# EAGLE design Adafruit VL6180 Time of Flight Sensor (EAGLE 9.6.2)
COMPANY: ADAFRUIT INDUSTRIES; DRAWN: KTOWN; REV: A
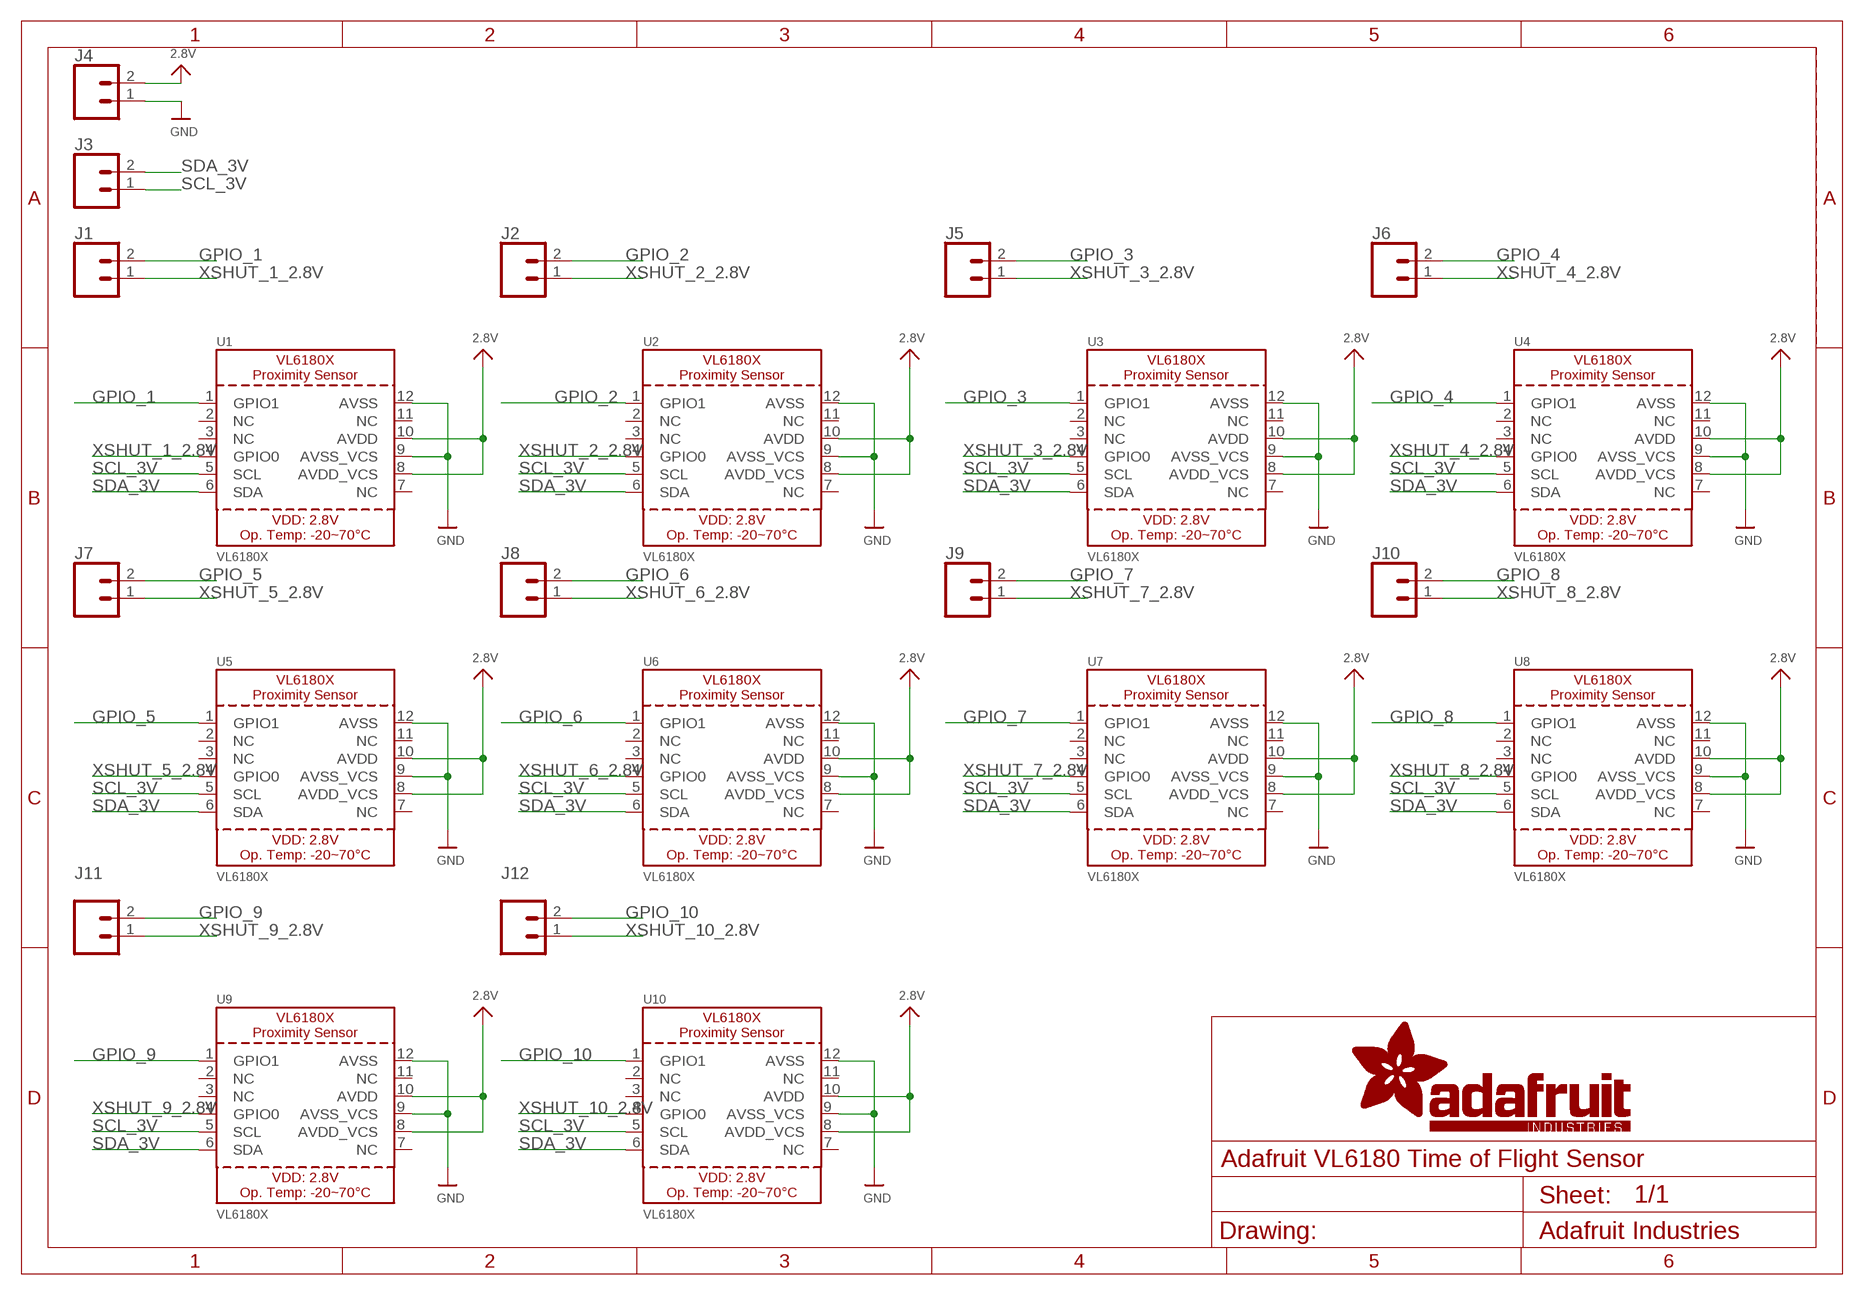
[diagram p0: schematic, sheet 1]

## Parts
J1  CONN_021X02_NO_SILK  [1X02_NO_SILK]
J2  CONN_021X02_NO_SILK  [1X02_NO_SILK]
J3  CONN_021X02_NO_SILK  [1X02_NO_SILK]
J4  CONN_021X02_NO_SILK  [1X02_NO_SILK]
J5  CONN_021X02_NO_SILK  [1X02_NO_SILK]
J6  CONN_021X02_NO_SILK  [1X02_NO_SILK]
J7  CONN_021X02_NO_SILK  [1X02_NO_SILK]
J8  CONN_021X02_NO_SILK  [1X02_NO_SILK]
J9  CONN_021X02_NO_SILK  [1X02_NO_SILK]
J10  CONN_021X02_NO_SILK  [1X02_NO_SILK]
J11  CONN_021X02_NO_SILK  [1X02_NO_SILK]
J12  CONN_021X02_NO_SILK  [1X02_NO_SILK]
U1  VL6180X  [VL6180]
U2  VL6180X  [VL6180]
U3  VL6180X  [VL6180]
U4  VL6180X  [VL6180]
U5  VL6180X  [VL6180]
U6  VL6180X  [VL6180]
U7  VL6180X  [VL6180]
U8  VL6180X  [VL6180]
U9  VL6180X  [VL6180]
U10  VL6180X  [VL6180]

## Nets
2.8V: J4.2 U1.8(AVDD_VCS) U1.10(AVDD) U2.8(AVDD_VCS) U2.10(AVDD) U3.8(AVDD_VCS) U3.10(AVDD) U4.8(AVDD_VCS) U4.10(AVDD) U5.8(AVDD_VCS) U5.10(AVDD) U6.8(AVDD_VCS) U6.10(AVDD) U7.8(AVDD_VCS) U7.10(AVDD) U8.8(AVDD_VCS) U8.10(AVDD) U9.8(AVDD_VCS) U9.10(AVDD) U10.8(AVDD_VCS) U10.10(AVDD)
GND: J4.1 U1.9(AVSS_VCS) U1.12(AVSS) U2.9(AVSS_VCS) U2.12(AVSS) U3.9(AVSS_VCS) U3.12(AVSS) U4.9(AVSS_VCS) U4.12(AVSS) U5.9(AVSS_VCS) U5.12(AVSS) U6.9(AVSS_VCS) U6.12(AVSS) U7.9(AVSS_VCS) U7.12(AVSS) U8.9(AVSS_VCS) U8.12(AVSS) U9.9(AVSS_VCS) U9.12(AVSS) U10.9(AVSS_VCS) U10.12(AVSS)
GPIO_1: J1.2 U1.1(GPIO1)
GPIO_2: J2.2 U2.1(GPIO1)
GPIO_3: J5.2 U3.1(GPIO1)
GPIO_4: J6.2 U4.1(GPIO1)
GPIO_5: J7.2 U5.1(GPIO1)
GPIO_6: J8.2 U6.1(GPIO1)
GPIO_7: J9.2 U7.1(GPIO1)
GPIO_8: J10.2 U8.1(GPIO1)
GPIO_9: J11.2 U9.1(GPIO1)
GPIO_10: J12.2 U10.1(GPIO1)
SCL_3V: J3.1 U1.5(SCL) U2.5(SCL) U3.5(SCL) U4.5(SCL) U5.5(SCL) U6.5(SCL) U7.5(SCL) U8.5(SCL) U9.5(SCL) U10.5(SCL)
SDA_3V: J3.2 U1.6(SDA) U2.6(SDA) U3.6(SDA) U4.6(SDA) U5.6(SDA) U6.6(SDA) U7.6(SDA) U8.6(SDA) U9.6(SDA) U10.6(SDA)
XSHUT_1_2.8V: J1.1 U1.4(GPIO0)
XSHUT_2_2.8V: J2.1 U2.4(GPIO0)
XSHUT_3_2.8V: J5.1 U3.4(GPIO0)
XSHUT_4_2.8V: J6.1 U4.4(GPIO0)
XSHUT_5_2.8V: J7.1 U5.4(GPIO0)
XSHUT_6_2.8V: J8.1 U6.4(GPIO0)
XSHUT_7_2.8V: J9.1 U7.4(GPIO0)
XSHUT_8_2.8V: J10.1 U8.4(GPIO0)
XSHUT_9_2.8V: J11.1 U9.4(GPIO0)
XSHUT_10_2.8V: J12.1 U10.4(GPIO0)
Unconnected: U1.2(NC) U1.3(NC) U1.7(NC) U1.11(NC) U2.2(NC) U2.3(NC) U2.7(NC) U2.11(NC) U3.2(NC) U3.3(NC) U3.7(NC) U3.11(NC) U4.2(NC) U4.3(NC) U4.7(NC) U4.11(NC) U5.2(NC) U5.3(NC) U5.7(NC) U5.11(NC) U6.2(NC) U6.3(NC) U6.7(NC) U6.11(NC) U7.2(NC) U7.3(NC) U7.7(NC) U7.11(NC) U8.2(NC) U8.3(NC) U8.7(NC) U8.11(NC) U9.2(NC) U9.3(NC) U9.7(NC) U9.11(NC) U10.2(NC) U10.3(NC) U10.7(NC) U10.11(NC)

## Library data of the parts
J1-J12 = SparkFun-Connectors:CONN_02: Multi connection point. Often used as Generic Header-pin footprint for 0.1 inch spaced/style header connections On any of the 0.1 inch spaced packages, you can populate with these: Break Away Headers - Straight <https://www.sparkfun.com/products/116> (PRT-00116) Break Away Male Headers - Right Angle <https://www.sparkfun.com/products/553> (PRT-00553) Female Headers <https://www.sparkfun.com/products/115> (PRT-00115) Break Away Headers - Machine Pin <https://www.sparkfun.com/products/117> (PRT-00117) Break Away Female Headers - Swiss Machine Pin <https://www.sparkfun.com/products/743> (PRT-00743) For SCREWTERMINALS and SPRING TERMINALS visit here: Screw Terimnals on SparkFun.com <https://www.sparkfun.com/search/results?term=Screw+Terminals> (5mm/3.5mm/2.54mm spacing) This device is also useful as a general connection point to wire up your design to another part of your project. Our various solder wires solder well into these plated through hole pads. Hook-Up Wire - Assortment (Stranded, 22 AWG) <https://www.sparkfun.com/products/11375> (PRT-11375) Hook-Up Wire - Assortment (Solid Core, 22 AWG) <https://www.sparkfun.com/products/11367> (PRT-11367) View the entire wire category on our website here <https://www.sparkfun.com/categories/141> Special notes: Molex polarized connector foot print use with: PRT-08233 with associated crimp pins and housings. 2.54_SCREWTERM for use with PRT-10571. 3.5mm Screw Terminal footprints for PRT-08084 5mm Screw Terminal footprints for use with PRT-08432
U1-U10 = microbuilder:VL6180X: VL6180x Proximity and Light Sensor with Gesture Recognition Supply Level: 2.8V (3.0V Max!) Range: 0-10cm Light Sensor: 0..100K Lux (16-bit output) IR emitter: 850 nm I2C Address: 0x29 (7-bit)

## Net classes
1 highpower: width 0.406 mm, drill 0.483 mm
2 lowpower: width 0.305 mm, drill 0.483 mm

## Board
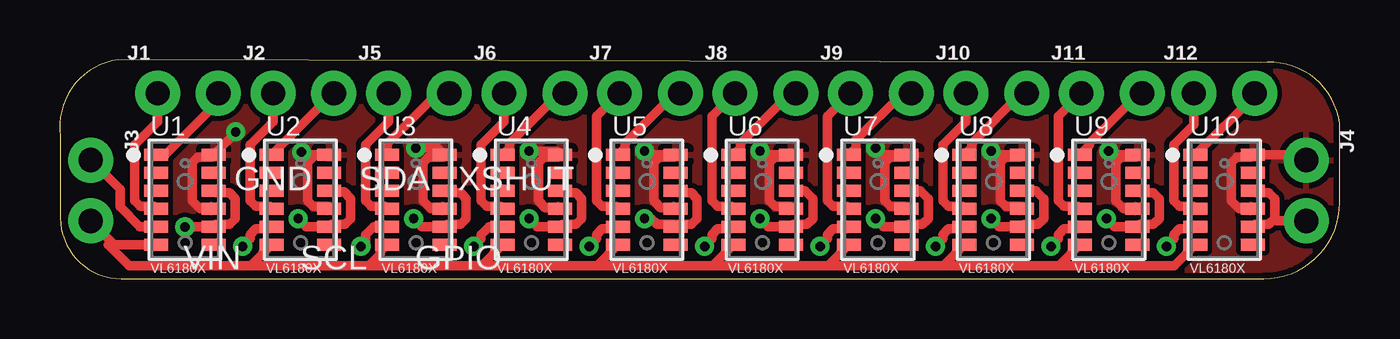
[diagram p1: board, top side]
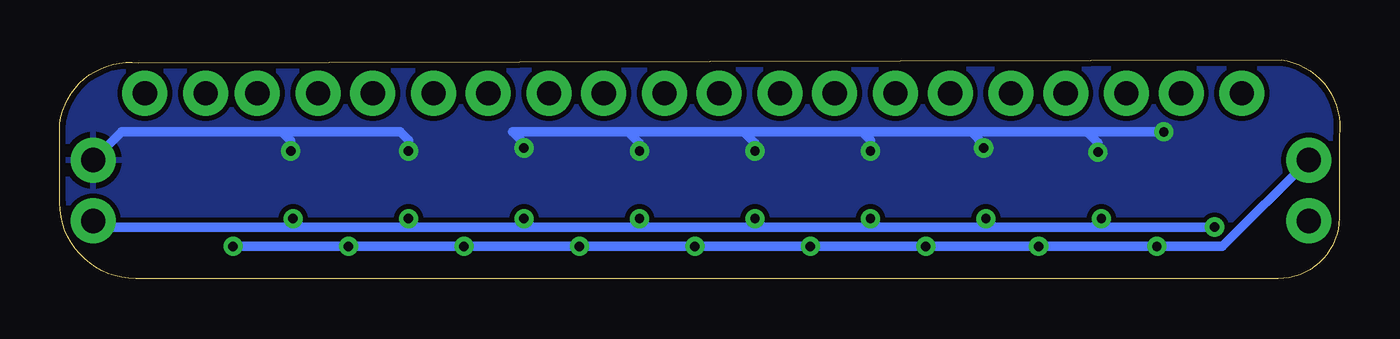
[diagram p2: board, bottom side, seen from below]

Size 53.49 x 9.14 mm. Coordinates in mm from the lower left corner, seen from the top.
Outline: 0.02,5.97 0.02,2.54 arc90 2.56,0 50.32,0 arc90 53.49,3.17 53.49,6.48 arc90 50.19,9.02 2.44,9.14 arc90 0.02,5.97
Copper layers (1*16): Top 0.035mm / dielectric 1.5mm / Bottom 0.035mm
Design rules "adafruit *": minimum track width 8mil, minimum drill 15.5mil, track to track 8mil, track to pad 8mil, pad to pad 8mil, via to via 8mil, smd to smd 8mil, copper to edge 10mil, drill to drill 8mil, minimum pad ring 10mil, minimum via ring 8mil, stop-mask expansion 2mil, vias tented up to drill 20mil, thermal gap 10mil

### Footprints (pad centres in the part's own frame; a part is rotated, then mirrored left to right if it is on the bottom)
1X02_NO_SILK = drill 1.016 pad 1.88: 1 0,0; 2 2.54,0
VL6180 = smd 1 x 0.5: 1 -1.2,1.875; 2 -1.2,1.125; 3 -1.2,0.375; 4 -1.2,-0.375; 5 -1.2,-1.125; 6 -1.2,-1.875; 7 1.2,-1.875; 8 1.2,-1.125; 9 1.2,-0.375; 10 1.2,0.375; 11 1.2,1.125; 12 1.2,1.875

### Placement (x,y rotation side)
J1  4.09,7.75 0 top
J2  8.91,7.75 0 top
J3  1.29,4.95 270 top
J4  52.09,4.95 270 top
J5  13.74,7.75 0 top
J6  18.57,7.75 0 top
J7  23.39,7.75 0 top
J8  28.22,7.75 0 top
J9  33.04,7.75 0 top
J10  37.87,7.75 0 top
J11  42.7,7.75 0 top
J12  47.39,7.75 0 top
U1  5.23,3.3 0 top
U2  10.06,3.3 0 top
U3  14.88,3.3 0 top
U4  19.71,3.3 0 top
U5  24.53,3.3 0 top
U6  29.36,3.3 0 top
U7  34.19,3.3 0 top
U8  39.01,3.3 0 top
U9  43.84,3.3 0 top
U10  48.66,3.3 0 top

### Tracks (layer width: path | path; a pad name or v marks a point on that pad's centre or on a via)
2.8V  (via drill 0.39)
  Top 0.406: U1.10 6.52,3.58 7.1,3.58 7.34,3.35 7.34,2.51 7.1,2.27 6.52,2.27 U1.8 5.25,2.18 v5.23,2.16 | U2.10 11.3,3.63 11.88,3.63 12.16,3.35 12.16,2.51 11.92,2.27 11.35,2.27 U2.8 10.29,2.18 v9.96,2.51 | U3.10 16.18,3.58 16.75,3.58 16.99,3.35 16.99,2.51 16.75,2.27 16.18,2.27 U3.8 15.12,2.18 v14.79,2.51 | U4.10 21,3.58 21.58,3.58 21.81,3.35 21.81,2.51 21.58,2.27 21,2.27 U4.8 19.94,2.18 v19.61,2.51 | U5.10 25.83,3.58 26.4,3.58 26.64,3.35 26.64,2.51 26.4,2.27 25.83,2.27 U5.8 25.64,2.27 24.95,2.27 24.72,2.51 v24.44,2.51 | U6.10 31.14,3.68 31.14,3.67 31.47,3.35 31.47,2.51 31.23,2.27 30.65,2.27 U6.8 29.6,2.18 v29.26,2.51 | U7.10 35.96,3.68 35.96,3.67 36.29,3.35 36.29,2.51 36.05,2.27 35.48,2.27 U7.8 34.42,2.18 v34.09,2.51 | U8.10 40.79,3.68 40.79,3.67 41.12,3.35 41.12,2.51 40.88,2.27 40.31,2.27 U8.8 39.25,2.18 v38.92,2.51 | U9.10 45.13,3.58 45.71,3.58 45.94,3.35 45.94,2.51 45.71,2.27 45.13,2.27 U9.8 44.07,2.18 v43.74,2.51 | 50.77,2.51 50.77,3.35 50.53,3.58 49.96,3.58 U10.10 | U10.8 49.96,2.27 50.53,2.27 50.77,2.51 | 50.77,2.51 50.87,2.41 J4.2
  Bottom 0.406: v5.23,2.16 10.31,2.16 | J4.2 51.84,2.16 43.39,2.16 | 10.31,2.16 14.44,2.16 | 14.44,2.16 19.26,2.16 | 19.26,2.16 24.09,2.16 | 24.09,2.16 28.91,2.16 | 28.91,2.16 33.74,2.16 | 33.74,2.16 38.57,2.16 | 43.39,2.16 38.57,2.16 | v9.96,2.51 10.31,2.16 | v29.26,2.51 28.91,2.16 | v14.79,2.51 14.44,2.16 | v19.61,2.51 19.26,2.16 | v24.44,2.51 24.09,2.16 | v34.09,2.51 33.74,2.16 | v38.92,2.51 38.57,2.16 | v43.74,2.51 43.39,2.16
GND  (via drill 0.39)
  Top 0.406: U1.9 5.87,2.92 5.77,3.02 5.76,3.02 5.52,3.26 5.52,4.84 5.76,5.08 6.34,5.08 U1.12 7.35,6.1 v7.35,6.14 | U2.9 11.16,3.02 10.59,3.02 10.35,3.26 10.35,4.84 10.68,5.18 U2.12 10.21,5.18 v10.11,5.29 | U3.9 15.52,2.92 15.42,3.02 15.41,3.02 15.18,3.26 15.18,4.84 15.41,5.08 15.99,5.08 U3.12 15.8,5.46 v14.88,5.46 | v19.61,5.33 20.75,5.33 U4.12 20.81,5.08 20.24,5.08 20,4.84 20,3.26 20.29,2.97 20.86,2.97 U4.9 | U5.9 25.69,2.97 25.11,2.97 24.83,3.26 24.83,4.84 25.07,5.08 25.64,5.08 U5.12 24.59,5.18 v24.44,5.33 | U6.9 30.47,3.02 29.89,3.02 29.65,3.26 29.65,4.84 29.89,5.08 30.47,5.08 U6.12 29.42,5.18 v29.26,5.33 | U7.9 35.29,3.02 34.72,3.02 34.48,3.26 34.48,4.84 34.72,5.08 35.29,5.08 U7.12 34.37,5.18 v34.09,5.46 | U8.9 40.12,3.02 39.54,3.02 39.31,3.26 39.31,4.84 39.54,5.08 40.12,5.08 U8.12 39.07,5.18 v38.92,5.33 | U9.9 44.47,2.92 44.37,3.02 44.13,3.26 44.13,4.84 44.37,5.08 44.94,5.08 U9.12 44,5.18 v43.84,5.33 | U10.9 49.3,2.92 49.2,3.02 48.96,3.26 48.96,4.84 49.2,5.08 49.77,5.08 U10.12 51.87,5.18 52,5.05 | 52,5.05 | 52,5.05 J4.1
  Bottom 0.406: v7.35,6.14 10.56,6.14 | 10.56,6.14 15.39,6.14 | J4.1 50.91,6.14 44.22,6.14 | 44.22,6.14 39.27,6.14 38.92,5.79 v38.92,5.33 | 29.74,6.14 34.57,6.14 34.09,5.66 v34.09,5.46 | 29.74,6.14 24.92,6.14 | 24.92,6.14 19.96,6.14 | 19.96,6.14 15.39,6.14 | v10.11,5.29 10.11,5.68 10.56,6.14 | v14.88,5.46 14.88,5.63 15.39,6.14 | v24.44,5.33 24.44,5.66 24.92,6.14 | v29.26,5.33 29.26,5.66 29.74,6.14 | v19.61,5.33 19.61,5.79 19.96,6.14 | v43.84,5.33 43.84,5.75 44.22,6.14
  pour Top: 0.02,9.02 53.49,9.02 53.49,0 0.02,0
  pour Bottom: 0.02,9.02 53.49,9.02 53.49,0 0.02,0
GPIO_1
  Top 0.406: U1.1 4.41,5.18 6.63,7.39 J1.2
GPIO_2
  Top 0.406: U2.1 11.43,7.75 J2.2
GPIO_3
  Top 0.406: U3.1 13.68,5.64 15.79,7.75 J5.2
GPIO_4
  Top 0.406: U4.1 18.81,5.47 18.81,5.67 20.88,7.75 J6.2
GPIO_5
  Top 0.406: U5.1 23.63,5.47 23.63,5.67 25.71,7.75 J7.2
GPIO_6
  Top 0.406: U6.1 28.46,5.47 28.46,5.67 30.54,7.75 J8.2
GPIO_7
  Top 0.406: U7.1 33.28,5.47 33.28,5.79 35.24,7.75 J9.2
GPIO_8
  Top 0.406: U8.1 38.11,5.47 38.11,5.67 40.19,7.75 J10.2
GPIO_9
  Top 0.406: J11.2 45.11,7.75 43.03,5.67 43.03,5.57 U9.1
GPIO_10
  Top 0.406: U10.1 49.93,7.65 J12.2
SCL_3V  (via drill 0.39)
  Top 0.406: U2.5 8.76,2.08 8.19,2.08 7.95,1.84 7.95,1.66 v7.64,1.35 | v12.58,1.35 12.78,1.55 12.78,1.84 13.11,2.18 U3.5 | J3.1 2.51,3.73 2.51,3.01 3.34,2.18 U1.5 | v17.3,1.35 17.6,1.66 17.6,1.84 17.93,2.18 U4.5 | U5.5 23.24,2.08 22.67,2.08 22.43,1.84 22.43,1.66 v22.12,1.35 | U6.5 28.07,2.08 27.49,2.08 27.25,1.84 27.25,1.66 v26.95,1.35 | U7.5 32.89,2.08 32.32,2.08 32.08,1.84 32.08,1.66 v31.77,1.35 | U8.5 37.72,2.08 37.14,2.08 36.91,1.84 36.91,1.66 v36.6,1.35 | U9.5 42.54,2.08 41.97,2.08 41.73,1.84 41.73,1.66 v41.43,1.35 | U10.5 47.37,2.08 46.8,2.08 46.56,1.84 46.56,1.66 v46.25,1.35
  Bottom 0.406: J3.1 4.9,1.35 v7.64,1.35 v12.58,1.35 v17.3,1.35 v22.12,1.35 v26.95,1.35 v31.77,1.35 v36.6,1.35 v41.43,1.35 v46.25,1.35
SDA_3V
  Top 0.406: 2.28,1.43 2.03,1.43 2.91,0.55 7.98,0.55 | 2.28,1.43 U1.6 | 2.28,1.43 J3.2 | 7.98,0.55 8.45,1.02 U2.6 | 12.91,0.55 13.39,1.02 13.39,1.13 U3.6 | 12.91,0.55 7.98,0.55 | 17.63,0.55 18.1,1.02 U4.6 | 17.63,0.55 12.91,0.55 | 22.46,0.55 22.93,1.02 U5.6 | 22.46,0.55 17.63,0.55 | 27.28,0.55 27.75,1.02 U6.6 | 27.28,0.55 22.46,0.55 | 32.11,0.55 32.58,1.02 U7.6 | 32.11,0.55 27.28,0.55 | U8.6 37.41,1.02 36.93,0.55 | 36.93,0.55 32.11,0.55 | 41.76,0.55 42.23,1.02 U9.6 | 41.76,0.55 36.93,0.55 | U10.6 47.06,1.02 46.59,0.55 41.76,0.55
XSHUT_1_2.8V
  Top 0.406: U1.4 3.94,3.02 3.36,3.02 3.12,3.26 3.12,5.59 4.09,6.56 J1.1
XSHUT_2_2.8V
  Top 0.406: U2.4 8.76,3.02 8.19,3.02 7.95,3.26 7.95,5.59 8.91,6.56 J2.1
XSHUT_3_2.8V
  Top 0.406: U3.4 13.59,3.02 13.01,3.02 12.78,3.26 12.78,5.59 13.74,6.56 J5.1
XSHUT_4_2.8V
  Top 0.406: U4.4 18.41,3.02 17.84,3.02 17.6,3.26 17.6,5.59 18.57,6.56 J6.1
XSHUT_5_2.8V
  Top 0.406: U5.4 23.24,3.02 22.67,3.02 22.43,3.26 22.43,6.78 J7.1
XSHUT_6_2.8V
  Top 0.406: J8.1 27.25,6.78 27.25,3.26 27.49,3.02 28.07,3.02 U6.4
XSHUT_7_2.8V
  Top 0.406: J9.1 32.08,6.78 32.08,3.26 32.32,3.02 32.89,3.02 U7.4
XSHUT_8_2.8V
  Top 0.406: U8.4 37.72,3.02 37.14,3.02 36.91,3.26 36.91,5.59 37.87,6.56 J10.1
XSHUT_9_2.8V
  Top 0.406: J11.1 41.73,6.78 41.73,3.26 41.97,3.02 42.54,3.02 U9.4
XSHUT_10_2.8V
  Top 0.406: J12.1 47.39,6.43 46.56,5.59 46.56,3.26 46.8,3.02 47.37,3.02 U10.4

### Text on the board
tPlace: VL6180 | ToF Distance | on | GND | SDA | XSHUT | VIN | SCL | GPIO